# EAGLE schematic FOCDriver (EAGLE 7.7.0)

## Sheet 1 of 2
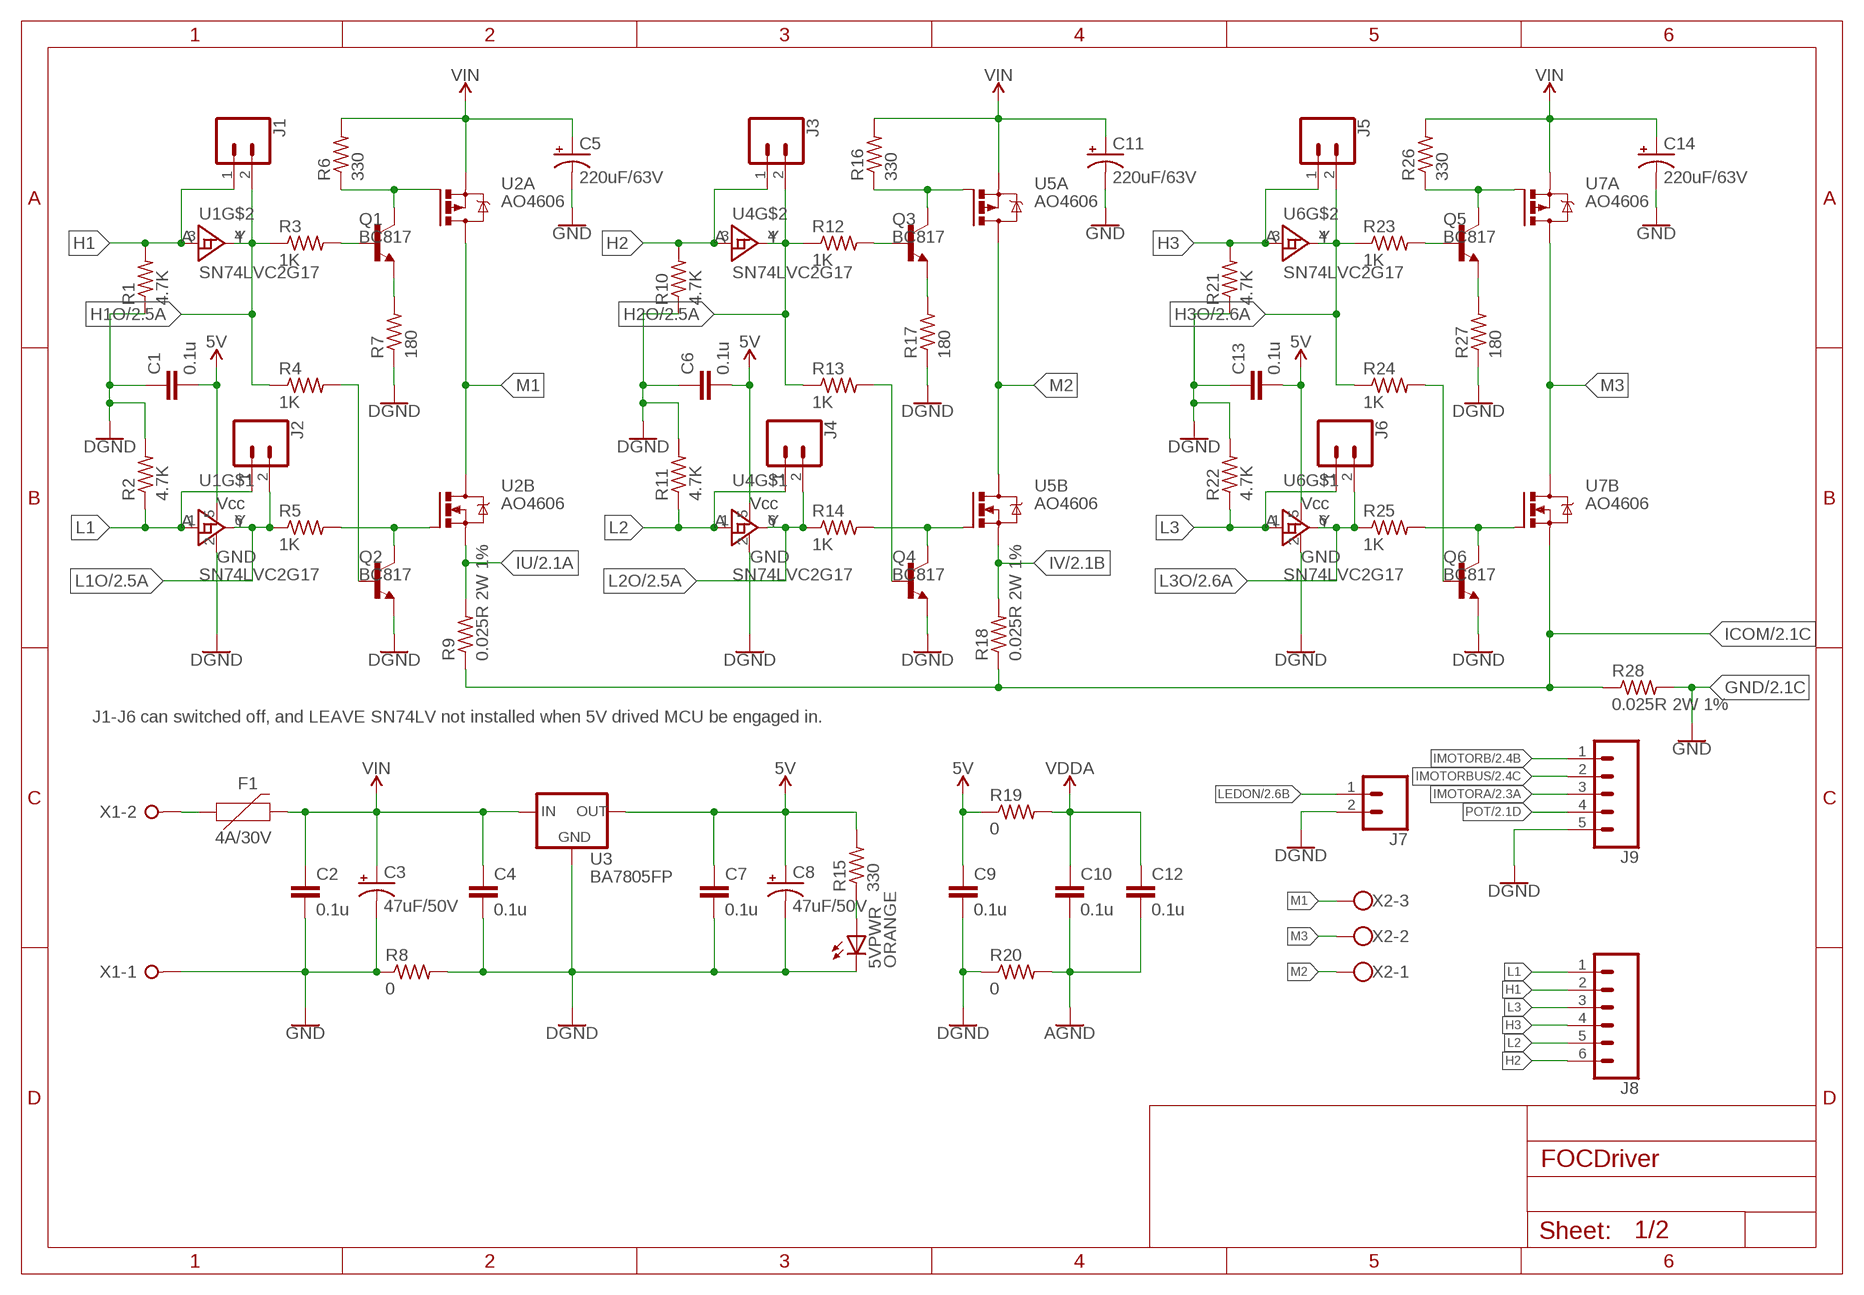
[diagram p0: schematic, sheet 1]

### Parts
5VPWR  ORANGE  LEDSML0805  [SML0805]
C1  0.1u  C-EUC0805  [C0805]
C2  0.1u  C-EUC0805  [C0805]
C3  47uF/50V  CPOL-USE2.5-7  [E2,5-7]
C4  0.1u  C-EUC0805  [C0805]
C5  220uF/63V  CPOL-USE5-10.5  [E5-10,5]
C6  0.1u  C-EUC0805  [C0805]
C7  0.1u  C-EUC0805  [C0805]
C8  47uF/50V  CPOL-USE2.5-7  [E2,5-7]
C9  0.1u  C-EUC0805  [C0805]
C10  0.1u  C-EUC0805  [C0805]
C11  220uF/63V  CPOL-USE5-10.5  [E5-10,5]
C12  0.1u  C-EUC0805  [C0805]
C13  0.1u  C-EUC0805  [C0805]
C14  220uF/63V  CPOL-USE5-10.5  [E5-10,5]
F1  4A/30V  PPTC_PTH  [PTH]
J1  CONN_02  [1X02]
J2  CONN_02  [1X02]
J3  CONN_02  [1X02]
J4  CONN_02  [1X02]
J5  CONN_02  [1X02]
J6  CONN_02  [1X02]
J7  CONN_02  [1X02]
J8  CONN_06SILK_FEMALE_PTH  [1X06]
J9  CONN_05  [1X05]
Q1  BC817  BC817-40SMD  [SOT23-BEC]
Q2  BC817  BC817-40SMD  [SOT23-BEC]
Q3  BC817  BC817-40SMD  [SOT23-BEC]
Q4  BC817  BC817-40SMD  [SOT23-BEC]
Q5  BC817  BC817-40SMD  [SOT23-BEC]
Q6  BC817  BC817-40SMD  [SOT23-BEC]
R1  4.7K  R-US_R0805  [R0805]
R2  4.7K  R-US_R0805  [R0805]
R3  1K  R-US_R0805  [R0805]
R4  1K  R-US_R0805  [R0805]
R5  1K  R-US_R0805  [R0805]
R6  330  R-US_R0805  [R0805]
R7  180  R-US_R0805  [R0805]
R8  0  R-US_R0805  [R0805]
R9  0.025R 2W 1%  R-US_R2512  [R2512]
R10  4.7K  R-US_R0805  [R0805]
R11  4.7K  R-US_R0805  [R0805]
R12  1K  R-US_R0805  [R0805]
R13  1K  R-US_R0805  [R0805]
R14  1K  R-US_R0805  [R0805]
R15  330  R-US_R0805  [R0805]
R16  330  R-US_R0805  [R0805]
R17  180  R-US_R0805  [R0805]
R18  0.025R 2W 1%  R-US_R2512  [R2512]
R19  0  R-US_R0805  [R0805]
R20  0  R-US_R0805  [R0805]
R21  4.7K  R-US_R0805  [R0805]
R22  4.7K  R-US_R0805  [R0805]
R23  1K  R-US_R0805  [R0805]
R24  1K  R-US_R0805  [R0805]
R25  1K  R-US_R0805  [R0805]
R26  330  R-US_R0805  [R0805]
R27  180  R-US_R0805  [R0805]
R28  0.025R 2W 1%  R-US_R2512  [R2512]
U1  SN74LVC2G17  [SOT23-6]
U2  AO4606  [SO08]
U3  BA7805FP  V_REG_78XX7812  [TO-252]
U4  SN74LVC2G17  [SOT23-6]
U5  AO4606  [SO08]
U6  SN74LVC2G17  [SOT23-6]
U7  AO4606  [SO08]
X1  W237-02P  [W237-132]
X2  W237-103  [W237-103]

### Nets
5V [5V]: C1.2 C6.2 C7.1 C8.+ C9.1 C13.2 R15.2 R19.1 U1.5(VCC) U3.2(OUT) U4.5(VCC) U6.5(VCC) ; also sheet 2
AGND [gnd]: C10.2 C12.2 R20.2 ; also sheet 2
DGND [gnd]: 5VPWR.C C1.1 C4.2 C6.1 C7.2 C8.- C9.2 C13.1 J7.2 J9.5 Q2.E Q4.E Q6.E R1.1 R2.2 R7.1 R8.2 R10.1 R11.2 R17.1 R20.1 R21.1 R22.2 R27.1 U1.2(GND) U3.3(GND) U4.2(GND) U6.2(GND) ; also sheet 2
GND [agnd]: C2.2 C3.- C5.- C11.- C14.- R8.1 R28.2 X1.1 ; also sheet 2
H1: J1.1 J8.2 R1.2 U1.3(A)
H1O: J1.2 R3.1 R4.1 U1.4(Y) ; also sheet 2
H2: J3.1 J8.6 R10.2 U4.3(A)
H2O: J3.2 R12.1 R13.1 U4.4(Y) ; also sheet 2
H3: J5.1 J8.4 R21.2 U6.3(A)
H3O: J5.2 R23.1 R24.1 U6.4(Y) ; also sheet 2
ICOM [agnd]: R9.1 R18.1 R28.1 U7.1(B:S) ; also sheet 2
IMOTORA: J9.3 ; also sheet 2
IMOTORB: J9.1 ; also sheet 2
IMOTORBUS: J9.2 ; also sheet 2
IU [agnd]: R9.2 U2.1(B:S) ; also sheet 2
IV [agnd]: R18.2 U5.1(B:S) ; also sheet 2
L1: J2.1 J8.1 R2.1 U1.1(A)
L1O: J2.2 R5.1 U1.6(Y) ; also sheet 2
L2: J4.1 J8.5 R11.1 U4.1(A)
L2O: J4.2 R14.1 U4.6(Y) ; also sheet 2
L3: J6.1 J8.3 R22.1 U6.1(A)
L3O: J6.2 R25.1 U6.6(Y) ; also sheet 2
LEDON: J7.1 ; also sheet 2
M1 [MOTOR]: U2.5(A:D) U2.6(A:D) U2.7(B:D) U2.8(B:D) X2.3
M2 [MOTOR]: U5.5(A:D) U5.6(A:D) U5.7(B:D) U5.8(B:D) X2.1
M3 [MOTOR]: U7.5(A:D) U7.6(A:D) U7.7(B:D) U7.8(B:D) X2.2
N$3: Q6.C R25.2 U7.2(B:G)
N$5 [+12V]: F1.P$1 X1.2
N$6: Q5.C R26.1 U7.4(A:G)
N$7: Q4.C R14.2 U5.2(B:G)
N$8: Q3.C R16.1 U5.4(A:G)
N$9: Q2.C R5.2 U2.2(B:G)
N$10: Q1.C R6.1 U2.4(A:G)
N$28: Q5.E R27.2
N$30: Q1.B R3.2
N$31: 5VPWR.A R15.1
N$32: Q2.B R4.2
N$39: Q3.B R12.2
N$40: Q1.E R7.2
N$41: Q4.B R13.2
N$42: Q5.B R23.2
N$43: Q3.E R17.2
N$44: Q6.B R24.2
POT: J9.4 ; also sheet 2
VDDA [VccIn]: C10.1 C12.1 R19.2 ; also sheet 2
VIN [+12V]: C2.1 C3.+ C4.1 C5.+ C11.+ C14.+ F1.P$2 R6.2 R16.2 R26.2 U2.3(A:S) U3.1(IN) U5.3(A:S) U7.3(A:S)

### Notes on the sheet
- J1-J6 can switched off, and LEAVE SN74LV not installed when 5V drived MCU be engaged in.

## Sheet 2 of 2
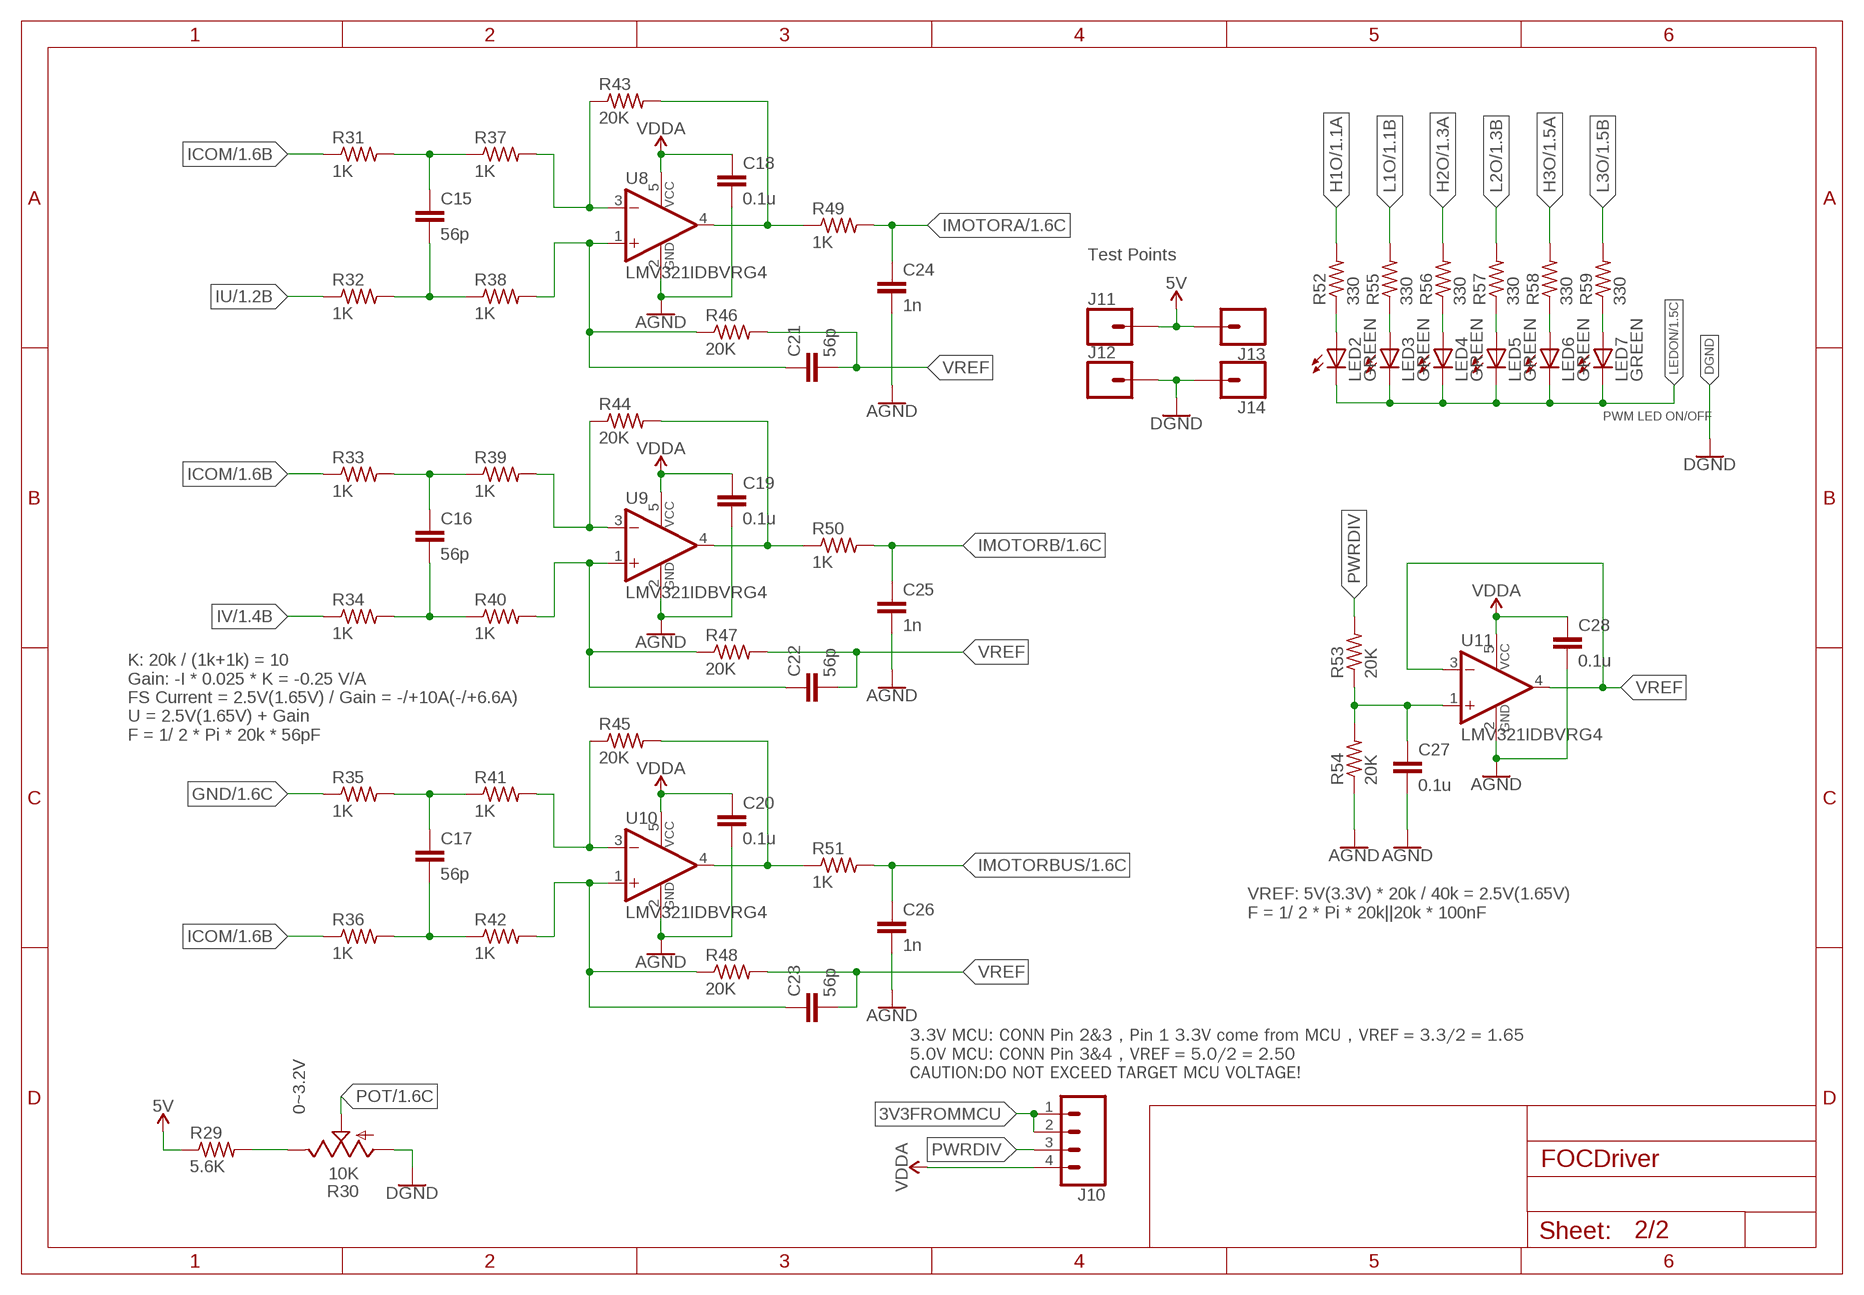
[diagram p1: schematic, sheet 2]

### Parts
C15  56p  C-EUC0805  [C0805]
C16  56p  C-EUC0805  [C0805]
C17  56p  C-EUC0805  [C0805]
C18  0.1u  C-EUC0805  [C0805]
C19  0.1u  C-EUC0805  [C0805]
C20  0.1u  C-EUC0805  [C0805]
C21  56p  C-EUC0805  [C0805]
C22  56p  C-EUC0805  [C0805]
C23  56p  C-EUC0805  [C0805]
C24  1n  C-EUC0805  [C0805]
C25  1n  C-EUC0805  [C0805]
C26  1n  C-EUC0805  [C0805]
C27  0.1u  C-EUC0805  [C0805]
C28  0.1u  C-EUC0805  [C0805]
J10  CONN_04  [1X04]
J11  CONN_01PTH_NO_SILK_YES_STOP  [1X01_NO_SILK]
J12  CONN_01PTH_NO_SILK_YES_STOP  [1X01_NO_SILK]
J13  CONN_01PTH_NO_SILK_YES_STOP  [1X01_NO_SILK]
J14  CONN_01PTH_NO_SILK_YES_STOP  [1X01_NO_SILK]
LED2  GREEN  LEDSML0805  [SML0805]
LED3  GREEN  LEDSML0805  [SML0805]
LED4  GREEN  LEDSML0805  [SML0805]
LED5  GREEN  LEDSML0805  [SML0805]
LED6  GREEN  LEDSML0805  [SML0805]
LED7  GREEN  LEDSML0805  [SML0805]
R29  5.6K  R-US_R0805  [R0805]
R30  10K  TRIM_US-CT6  [CT6]
R31  1K  R-US_R0805  [R0805]
R32  1K  R-US_R0805  [R0805]
R33  1K  R-US_R0805  [R0805]
R34  1K  R-US_R0805  [R0805]
R35  1K  R-US_R0805  [R0805]
R36  1K  R-US_R0805  [R0805]
R37  1K  R-US_R0805  [R0805]
R38  1K  R-US_R0805  [R0805]
R39  1K  R-US_R0805  [R0805]
R40  1K  R-US_R0805  [R0805]
R41  1K  R-US_R0805  [R0805]
R42  1K  R-US_R0805  [R0805]
R43  20K  R-US_R0805  [R0805]
R44  20K  R-US_R0805  [R0805]
R45  20K  R-US_R0805  [R0805]
R46  20K  R-US_R0805  [R0805]
R47  20K  R-US_R0805  [R0805]
R48  20K  R-US_R0805  [R0805]
R49  1K  R-US_R0805  [R0805]
R50  1K  R-US_R0805  [R0805]
R51  1K  R-US_R0805  [R0805]
R52  330  R-US_R0805  [R0805]
R53  20K  R-US_R0805  [R0805]
R54  20K  R-US_R0805  [R0805]
R55  330  R-US_R0805  [R0805]
R56  330  R-US_R0805  [R0805]
R57  330  R-US_R0805  [R0805]
R58  330  R-US_R0805  [R0805]
R59  330  R-US_R0805  [R0805]
U8  LMV321IDBVRG4  [SOT95P285X120-5N]
U9  LMV321IDBVRG4  [SOT95P285X120-5N]
U10  LMV321IDBVRG4  [SOT95P285X120-5N]
U11  LMV321IDBVRG4  [SOT95P285X120-5N]

### Nets
3V3FROMMCU: J10.1 J10.2
5V [5V]: J11.1 J13.1 R29.1 ; also sheet 1
AGND [gnd]: C18.2 C19.2 C20.2 C24.2 C25.2 C26.2 C27.2 C28.2 R54.1 U8.2(GND) U9.2(GND) U10.2(GND) U11.2(GND) ; also sheet 1
DGND [gnd]: J12.1 J14.1 R30.A ; also sheet 1
GND [agnd]: R35.1 ; also sheet 1
H1O: R52.2 ; also sheet 1
H2O: R56.2 ; also sheet 1
H3O: R58.2 ; also sheet 1
ICOM [agnd]: R31.1 R33.1 R36.1 ; also sheet 1
IMOTORA: C24.1 R49.2 ; also sheet 1
IMOTORB: C25.1 R50.2 ; also sheet 1
IMOTORBUS: C26.1 R51.2 ; also sheet 1
IU [agnd]: R32.1 ; also sheet 1
IV [agnd]: R34.1 ; also sheet 1
L1O: R55.2 ; also sheet 1
L2O: R57.2 ; also sheet 1
L3O: R59.2 ; also sheet 1
LEDON: LED2.C LED3.C LED4.C LED5.C LED6.C LED7.C ; also sheet 1
N$4: R29.2 R30.E
N$11: C15.1 R31.2 R37.1
N$12: C15.2 R32.2 R38.1
N$13: R37.2 R43.1 U8.3(-IN)
N$14: C16.1 R33.2 R39.1
N$15: C21.1 R38.2 R46.1 U8.1(+IN)
N$16: R43.2 R49.1 U8.4(OUT)
N$17: C16.2 R34.2 R40.1
N$18: C27.1 R53.1 R54.2 U11.1(+IN)
N$19: R39.2 R44.1 U9.3(-IN)
N$20: C22.1 R40.2 R47.1 U9.1(+IN)
N$21: R44.2 R50.1 U9.4(OUT)
N$22: C17.1 R35.2 R41.1
N$23: C17.2 R36.2 R42.1
N$24: R41.2 R45.1 U10.3(-IN)
N$25: C23.1 R42.2 R48.1 U10.1(+IN)
N$26: R45.2 R51.1 U10.4(OUT)
N$33: LED2.A R52.1
N$34: LED3.A R55.1
N$35: LED4.A R56.1
N$36: LED5.A R57.1
N$37: LED6.A R58.1
N$38: LED7.A R59.1
POT: R30.S ; also sheet 1
PWRDIV: J10.3 R53.2
VDDA [VccIn]: C18.1 C19.1 C20.1 C28.1 J10.4 U8.5(VCC) U9.5(VCC) U10.5(VCC) U11.5(VCC) ; also sheet 1
VREF: C21.2 C22.2 C23.2 R46.2 R47.2 R48.2 U11.3(-IN) U11.4(OUT)

### Notes on the sheet
- Test Points
- PWM LED ON/OFF
- K: 20k / (1k+1k) = 10
  Gain: -I * 0.025 * K = -0.25 V/A
  FS Current = 2.5V(1.65V) / Gain = -/+10A(-/+6.6A)
  U = 2.5V(1.65V) + Gain
  F = 1/ 2 * Pi * 20k * 56pF
- VREF: 5V(3.3V) * 20k / 40k = 2.5V(1.65V)
  F = 1/ 2 * Pi * 20k||20k * 100nF
- 3.3V MCU: CONN Pin 2&3，Pin 1 3.3V come from MCU，VREF = 3.3/2 = 1.65
  5.0V MCU: CONN Pin 3&4，VREF = 5.0/2 = 2.50
  CAUTION:DO NOT EXCEED TARGET MCU VOLTAGE!
- 0~3.2V

## Library data of the parts
5VPWR LED2-LED7 = led:LED: LED OSRAM: - CHIPLED LG R971, LG N971, LY N971, LG Q971, LY Q971, LO R971, LY R971 LH N974, LH R974 LS Q976, LO Q976, LY Q976 LO Q996 - Hyper CHIPLED LW Q18S LB Q993, LB Q99A, LB R99A - SideLED LS A670, LO A670, LY A670, LG A670, LP A670 LB A673, LV A673, LT A673, LW A673 LH A674 LY A675 LS A676, LA A676, LO A676, LY A676, LW A676 LS A679, LY A679, LG A679 - Hyper Micro SIDELED® LS Y876, LA Y876, LO Y876, LY Y876 LT Y87S - SmartLED LW L88C, LW L88S LB L89C, LB L89S, LG L890 LS L89K, LO L89K, LY L89K LS L896, LA L896, LO L896, LY L896 - TOPLED LS T670, LO T670, LY T670, LG T670, LP T670 LSG T670, LSP T670, LSY T670, LOP T670, LYG T670 LG T671, LOG T671, LSG T671 LB T673, LV T673, LT T673, LW T673 LH T674 LS T676, LA T676, LO T676, LY T676, LB T676, LH T676, LSB T676, LW T676 LB T67C, LV T67C, LT T67C, LS T67K, LO T67K, LY T67K, LW E67C LS E67B, LA E67B, LO E67B, LY E67B, LB E67C, LV E67C, LT E67C LW T67C LS T679, LY T679, LG T679 LS T770, LO T770, LY T770, LG T770, LP T770 LB T773, LV T773, LT T773, LW T773 LH T774 LS E675, LA E675, LY E675, LS T675 LS T776, LA T776, LO T776, LY T776, LB T776 LHGB T686 LT T68C, LB T68C - Hyper Mini TOPLED® LB M676 - Mini TOPLED Santana® LG M470 LS M47K, LO M47K, LY M47K Source: http://www.osram.convergy.de LUXEON: - LUMILED® LXK2-PW12-R00, LXK2-PW12-S00, LXK2-PW14-U00, LXK2-PW14-V00 LXK2-PM12-R00, LXK2-PM12-S00, LXK2-PM14-U00 LXK2-PE12-Q00, LXK2-PE12-R00, LXK2-PE12-S00, LXK2-PE14-T00, LXK2-PE14-U00 LXK2-PB12-K00, LXK2-PB12-L00, LXK2-PB12-M00, LXK2-PB14-N00, LXK2-PB14-P00, LXK2-PB14-Q00 LXK2-PR12-L00, LXK2-PR12-M00, LXK2-PR14-Q00, LXK2-PR14-R00 LXK2-PD12-Q00, LXK2-PD12-R00, LXK2-PD12-S00 LXK2-PH12-R00, LXK2-PH12-S00 LXK2-PL12-P00, LXK2-PL12-Q00, LXK2-PL12-R00 Source: www.luxeon.com KINGBRIGHT: KA-3528ASYC Source: www.kingbright.com
C1 C2 C4 C6 C7 C9 C10 C12 C13 C15-C28 = rcl:C-EU: CAPACITOR, European symbol
C3 C5 C8 C11 C14 = rcl:CPOL-US: POLARIZED CAPACITOR, American symbol
F1 = SparkFun-Fuses:PPTC: Resettable Fuse PPTC Resettable Fuse. Really a sort of resistor with a polymeric positive temperature coefficient whose resistance increases dramatically with an increase in temperature. When heated by the power passing through the resistance rises causing the current to be limited, protecting the circuit. This is achieved by the transition of the polymer from a crystalline to an amorphous state where the conductive carbon separates breaking the conductive pathways found in the cool crystalline structure. When a PPTC cools back down it resumes conducting letting the circuit turn back on. SparkFun Products: SparkFun RedBoard - Programmed with Arduino <https://www.sparkfun.com/products/12757> Pro Micro - 5V/16MHz <https://www.sparkfun.com/products/12640> Arduino Pro 328 - 5V/16MHz <https://www.sparkfun.com/products/10915> MP3 Trigger <https://www.sparkfun.com/products/13720>; PROD_ID: RES-08490; VALUE: 72V/0.25A
J1-J7 = SparkFun-Connectors:CONN_02: Multi connection point. Often used as Generic Header-pin footprint for 0.1 inch spaced/style header connections On any of the 0.1 inch spaced packages, you can populate with these: Break Away Headers - Straight <https://www.sparkfun.com/products/116> (PRT-00116) Break Away Male Headers - Right Angle <https://www.sparkfun.com/products/553> (PRT-00553) Female Headers <https://www.sparkfun.com/products/115> (PRT-00115) Break Away Headers - Machine Pin <https://www.sparkfun.com/products/117> (PRT-00117) Break Away Female Headers - Swiss Machine Pin <https://www.sparkfun.com/products/743> (PRT-00743) For SCREWTERMINALS and SPRING TERMINALS visit here: Screw Terimnals on SparkFun.com <https://www.sparkfun.com/search/results?term=Screw+Terminals> (5mm/3.5mm/2.54mm spacing) This device is also useful as a general connection point to wire up your design to another part of your project. Our various solder wires solder well into these plated through hole pads. Hook-Up Wire - Assortment (Stranded, 22 AWG) <https://www.sparkfun.com/products/11375> (PRT-11375) Hook-Up Wire - Assortment (Solid Core, 22 AWG) <https://www.sparkfun.com/products/11367> (PRT-11367) View the entire wire category on our website here <https://www.sparkfun.com/categories/141> Special notes: Molex polarized connector foot print use with: PRT-08233 with associated crimp pins and housings. 2.54_SCREWTERM for use with PRT-10571. 3.5mm Screw Terminal footprints for PRT-08084 5mm Screw Terminal footprints for use with PRT-08432
J8 = SparkFun-Connectors:CONN_06: Multi connection point. Often used as Generic Header-pin footprint for 0.1 inch spaced/style header connections On any of the 0.1 inch spaced packages, you can populate with these: Break Away Headers - Straight <https://www.sparkfun.com/products/116> (PRT-00116) Break Away Male Headers - Right Angle <https://www.sparkfun.com/products/553> (PRT-00553) Female Headers <https://www.sparkfun.com/products/115> (PRT-00115) Break Away Headers - Machine Pin <https://www.sparkfun.com/products/117> (PRT-00117) Break Away Female Headers - Swiss Machine Pin <https://www.sparkfun.com/products/743> (PRT-00743) Arduino Stackable Header - 6 Pin <https://www.sparkfun.com/products/9280> (PRT-09280) For SCREWTERMINALS and SPRING TERMINALS visit here: Screw Terimnals on SparkFun.com <https://www.sparkfun.com/search/results?term=Screw+Terminals> (5mm/3.5mm/2.54mm spacing) This device is also useful as a general connection point to wire up your design to another part of your project. Our various solder wires solder well into these plated through hole pads. Hook-Up Wire - Assortment (Stranded, 22 AWG) <https://www.sparkfun.com/products/11375> (PRT-11375) Hook-Up Wire - Assortment (Solid Core, 22 AWG) <https://www.sparkfun.com/products/11367> (PRT-11367) View the entire wire category on our website here <https://www.sparkfun.com/categories/141>; PROD_ID: CONN-08437
J9 = SparkFun-Connectors:CONN_05: Multi connection point. Often used as Generic Header-pin footprint for 0.1 inch spaced/style header connections On any of the 0.1 inch spaced packages, you can populate with these: Break Away Headers - Straight <https://www.sparkfun.com/products/116> (PRT-00116) Break Away Male Headers - Right Angle <https://www.sparkfun.com/products/553> (PRT-00553) Female Headers <https://www.sparkfun.com/products/115> (PRT-00115) Break Away Headers - Machine Pin <https://www.sparkfun.com/products/117> (PRT-00117) Break Away Female Headers - Swiss Machine Pin <https://www.sparkfun.com/products/743> (PRT-00743) For SCREWTERMINALS and SPRING TERMINALS visit here: Screw Terimnals on SparkFun.com <https://www.sparkfun.com/search/results?term=Screw+Terminals> (5mm/3.5mm/2.54mm spacing) This device is also useful as a general connection point to wire up your design to another part of your project. Our various solder wires solder well into these plated through hole pads. Hook-Up Wire - Assortment (Stranded, 22 AWG) <https://www.sparkfun.com/products/11375> (PRT-11375) Hook-Up Wire - Assortment (Solid Core, 22 AWG) <https://www.sparkfun.com/products/11367> (PRT-11367) View the entire wire category on our website here <https://www.sparkfun.com/categories/141> Special notes: Molex polarized connector foot print use with SKU : PRT-08231 with associated crimp pins and housings. 1MM SMD Version SKU: PRT-10208
J10 = SparkFun-Connectors:CONN_04: Multi connection point. Often used as Generic Header-pin footprint for 0.1 inch spaced/style header connections On any of the 0.1 inch spaced packages, you can populate with these: Break Away Headers - Straight <https://www.sparkfun.com/products/116> (PRT-00116) Break Away Male Headers - Right Angle <https://www.sparkfun.com/products/553> (PRT-00553) Female Headers <https://www.sparkfun.com/products/115> (PRT-00115) Break Away Headers - Machine Pin <https://www.sparkfun.com/products/117> (PRT-00117) Break Away Female Headers - Swiss Machine Pin <https://www.sparkfun.com/products/743> (PRT-00743) For SCREWTERMINALS and SPRING TERMINALS visit here: Screw Terimnals on SparkFun.com <https://www.sparkfun.com/search/results?term=Screw+Terminals> (5mm/3.5mm/2.54mm spacing) This device is also useful as a general connection point to wire up your design to another part of your project. Our various solder wires solder well into these plated through hole pads. Hook-Up Wire - Assortment (Stranded, 22 AWG) <https://www.sparkfun.com/products/11375> (PRT-11375) Hook-Up Wire - Assortment (Solid Core, 22 AWG) <https://www.sparkfun.com/products/11367> (PRT-11367) View the entire wire category on our website here <https://www.sparkfun.com/categories/141> Special notes: Molex polarized connector foot print use with SKU : PRT-08231 with associated crimp pins and housings. 1MM SMD Version SKU: PRT-10208; PROD_ID: CONN-09696
J11-J14 = SparkFun-Connectors:CONN_01: Single connection point. Often used as Generic Header-pin footprint for 0.1 inch spaced/style header connections On any of the 0.1 inch spaced packages, you can populate with these: Break Away Headers - Straight <https://www.sparkfun.com/products/116> (PRT-00116) Break Away Male Headers - Right Angle <https://www.sparkfun.com/products/553> (PRT-00553) Female Headers <https://www.sparkfun.com/products/115> (PRT-00115) Break Away Headers - Machine Pin <https://www.sparkfun.com/products/117> (PRT-00117) Break Away Female Headers - Swiss Machine Pin <https://www.sparkfun.com/products/743> (PRT-00743) This device is also useful as a general connection point to wire up your design to another part of your project. Our various solder wires solder well into these plated through hole pads. Hook-Up Wire - Assortment (Stranded, 22 AWG) <https://www.sparkfun.com/products/11375> (PRT-11375) Hook-Up Wire - Assortment (Solid Core, 22 AWG) <https://www.sparkfun.com/products/11367> (PRT-11367) View the entire wire category on our website here <https://www.sparkfun.com/categories/141> Special notes: SMTSO-256-ET is a "flush mount" nut for a 4-40 screw. We mostly use this on specialty testbeds; it is a nice way to connect hardware to your PCB at an adjustable hieght. Also note, the SNAP packages are for using a snappable style connector. We sell a baggie of snaps and they are also used on two LilyPad designs: Snap Assortment - 30 pack (male and female) <https://www.sparkfun.com/products/11347> (DEV-11347) LilyPad Arduino SimpleSnap <https://www.sparkfun.com/products/10941> (DEV-10941) LilyPad SimpleSnap Protoboard <https://www.sparkfun.com/products/10940> (DEV-10940)
Q1-Q6 = transistor-npn:BC817*: NPN Transistor
R1-R8 R10-R17 R19-R27 R29 R31-R59 = rcl:R-US_: RESISTOR, American symbol
R9 R18 R28 = resistor:R-US_: RESISTOR, American symbol
R30 = pot:TRIM_US-: POTENTIOMETER
U1 U4 U6 = SN74LVC:SN74LVC2G17
U2 U5 U7 = AO4606:AO4606
U3 = SparkFun-IC-Power:V_REG_78XX: Voltage Regulator Standard 78xx regulator. IGO (Input Ground Output). Spark Fun Electronics SKU : COM-00107; PROD_ID: VREG-12370; VALUE: +12v
U8-U11 = LMV321IDBVRG4:LMV321IDBVRG4: IC OPAMP SGL 1.8V 1MHZ
X1 = con-wago-508:W237-02P: WAGO SREW CLAMP; OC_FARNELL: unknown; OC_NEWARK: unknown
X2 = con-wago-500:W237-103: WAGO SCREW CLAMP; MPN: 237-103; OC_FARNELL: unknown; OC_NEWARK: 18M7116

## Net classes
0 default: width 0.254 mm, drill 0.254 mm, clearance 0.254 mm
1 VccIn: width 0.305 mm, drill 0.254 mm, clearance 0.305 mm
2 gnd: width 0.305 mm, drill 0.254 mm, clearance 0.305 mm
3 +12V: width 0.61 mm, drill 0.508 mm, clearance 0.508 mm
4 agnd: width 0.61 mm, drill 0.508 mm, clearance 0.508 mm
5 5V: width 0.305 mm, drill 0.254 mm, clearance 0.305 mm
6 MOTOR: width 1.016 mm, clearance 0.61 mm